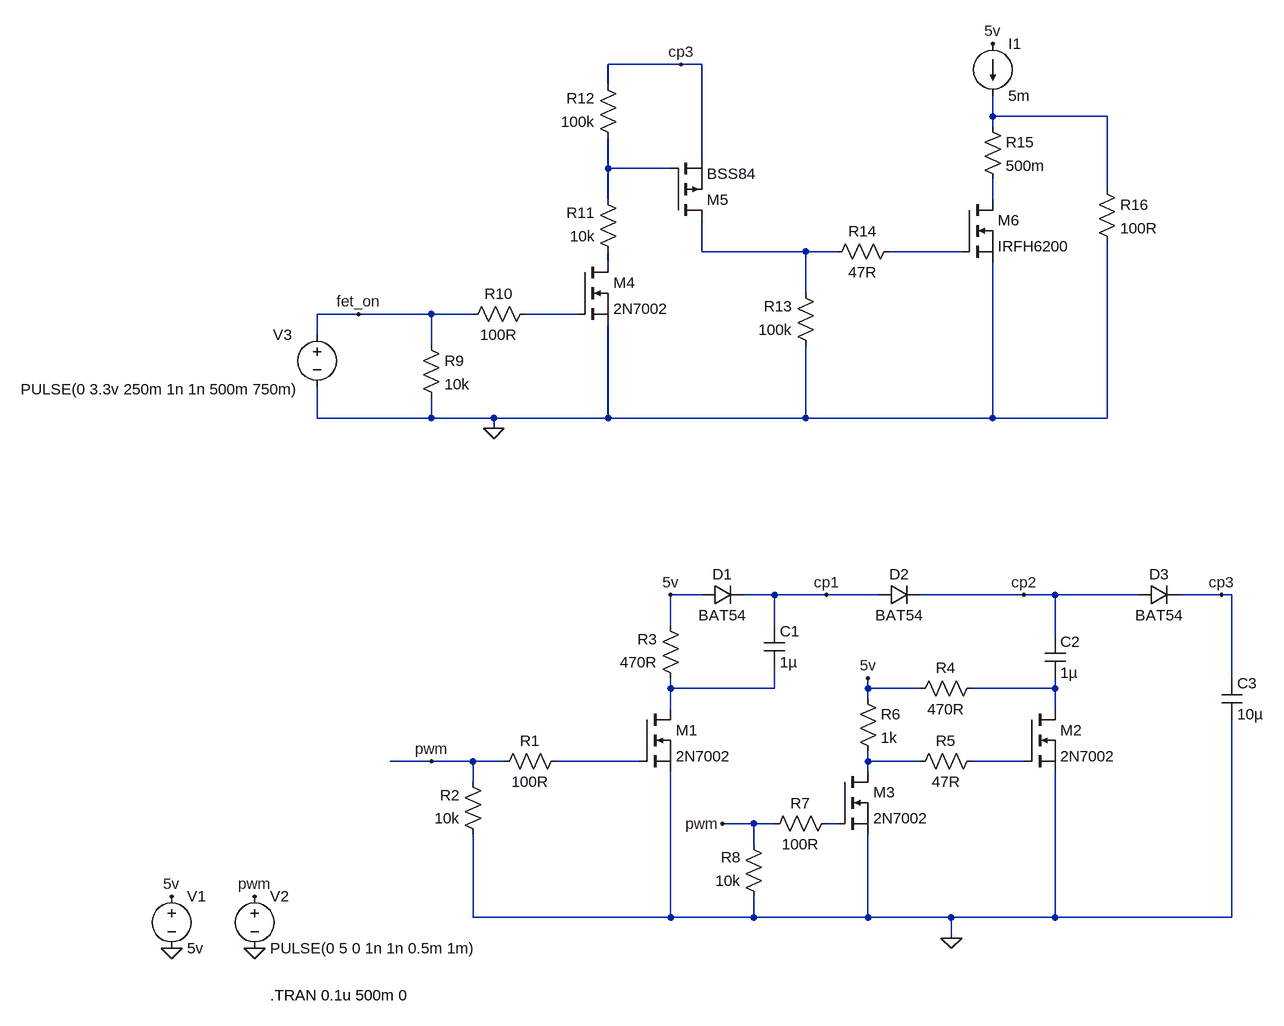
[diagram p0: schematic Charge Pump and FET Switch.asc]
Charge Pump and FET Switch.asc, the LTspice schematic file:
Version 4
SHEET 1 1676 760
WIRE 672 -688 560 -688
WIRE 704 -688 672 -688
WIRE 560 -656 560 -688
WIRE 1152 -608 1152 -640
WIRE 1328 -608 1152 -608
WIRE 1152 -592 1152 -608
WIRE 704 -544 704 -688
WIRE 560 -528 560 -576
WIRE 656 -528 560 -528
WIRE 1328 -496 1328 -608
WIRE 560 -480 560 -528
WIRE 1152 -480 1152 -512
WIRE 704 -400 704 -448
WIRE 864 -400 704 -400
WIRE 912 -400 864 -400
WIRE 1104 -400 992 -400
WIRE 560 -384 560 -400
WIRE 864 -336 864 -400
WIRE 176 -304 112 -304
WIRE 288 -304 176 -304
WIRE 352 -304 288 -304
WIRE 512 -304 432 -304
WIRE 112 -272 112 -304
WIRE 288 -256 288 -304
WIRE 112 -144 112 -192
WIRE 288 -144 288 -176
WIRE 288 -144 112 -144
WIRE 384 -144 288 -144
WIRE 560 -144 560 -288
WIRE 560 -144 384 -144
WIRE 864 -144 864 -256
WIRE 864 -144 560 -144
WIRE 1152 -144 1152 -384
WIRE 1152 -144 864 -144
WIRE 1328 -144 1328 -416
WIRE 1328 -144 1152 -144
WIRE 384 -128 384 -144
WIRE 704 128 656 128
WIRE 816 128 768 128
WIRE 896 128 816 128
WIRE 976 128 896 128
WIRE 1200 128 1040 128
WIRE 1248 128 1200 128
WIRE 1376 128 1248 128
WIRE 1504 128 1440 128
WIRE 1520 128 1504 128
WIRE 656 176 656 128
WIRE 816 176 816 128
WIRE 1248 192 1248 128
WIRE 1520 256 1520 128
WIRE 656 272 656 256
WIRE 816 272 816 240
WIRE 816 272 656 272
WIRE 960 272 960 256
WIRE 1040 272 960 272
WIRE 1248 272 1248 256
WIRE 1248 272 1120 272
WIRE 960 288 960 272
WIRE 656 304 656 272
WIRE 1248 304 1248 272
WIRE 288 384 224 384
WIRE 352 384 288 384
WIRE 400 384 352 384
WIRE 608 384 480 384
WIRE 960 384 960 368
WIRE 1040 384 960 384
WIRE 1200 384 1120 384
WIRE 960 400 960 384
WIRE 352 416 352 384
WIRE 784 480 736 480
WIRE 816 480 784 480
WIRE 912 480 896 480
WIRE 784 512 784 480
WIRE 352 624 352 496
WIRE 656 624 656 400
WIRE 656 624 352 624
WIRE 784 624 784 592
WIRE 784 624 656 624
WIRE 960 624 960 496
WIRE 960 624 784 624
WIRE 1088 624 960 624
WIRE 1248 624 1248 400
WIRE 1248 624 1088 624
WIRE 1520 624 1520 320
WIRE 1520 624 1248 624
WIRE 1088 656 1088 624
FLAG -112 672 0
FLAG -112 592 5v
FLAG 16 672 0
FLAG 16 592 pwm
FLAG 656 128 5v
FLAG 960 256 5v
FLAG 1504 128 cp3
FLAG 1088 656 0
FLAG 736 480 pwm
FLAG 288 384 pwm
FLAG 1152 -720 5v
FLAG 672 -688 cp3
FLAG 384 -128 0
FLAG 176 -304 fet_on
FLAG 896 128 cp1
FLAG 1200 128 cp2
SYMBOL voltage -112 576 R0
SYMATTR InstName V1
SYMATTR Value 5v
SYMBOL res 496 368 R90
WINDOW 0 0 56 VBottom 2
WINDOW 3 32 56 VTop 2
SYMATTR InstName R1
SYMATTR Value 100R
SYMBOL res 368 512 R180
WINDOW 0 36 76 Left 2
WINDOW 3 36 40 Left 2
SYMATTR InstName R2
SYMATTR Value 10k
SYMBOL res 672 272 R180
WINDOW 0 36 76 Left 2
WINDOW 3 36 40 Left 2
SYMATTR InstName R3
SYMATTR Value 470R
SYMBOL res 1024 288 R270
WINDOW 0 32 56 VTop 2
WINDOW 3 0 56 VBottom 2
SYMATTR InstName R4
SYMATTR Value 470R
SYMBOL res 1024 400 R270
WINDOW 0 32 56 VTop 2
WINDOW 3 0 56 VBottom 2
SYMATTR InstName R5
SYMATTR Value 47R
SYMBOL res 944 272 R0
SYMATTR InstName R6
SYMATTR Value 1k
SYMBOL cap 800 176 R0
SYMATTR InstName C1
SYMATTR Value 1µ
SYMBOL cap 1232 192 R0
SYMATTR InstName C2
SYMATTR Value 1µ
SYMBOL cap 1504 256 R0
SYMATTR InstName C3
SYMATTR Value 10µ
SYMBOL diode 704 144 R270
WINDOW 0 32 32 VTop 2
WINDOW 3 0 32 VBottom 2
SYMATTR InstName D1
SYMATTR Value BAT54
SYMBOL diode 976 144 R270
WINDOW 0 32 32 VTop 2
WINDOW 3 0 32 VBottom 2
SYMATTR InstName D2
SYMATTR Value BAT54
SYMBOL diode 1376 144 R270
WINDOW 0 32 32 VTop 2
WINDOW 3 0 32 VBottom 2
SYMATTR InstName D3
SYMATTR Value BAT54
SYMBOL nmos 608 304 R0
SYMATTR InstName M1
SYMATTR Value 2N7002
SYMBOL nmos 1200 304 R0
SYMATTR InstName M2
SYMATTR Value 2N7002
SYMBOL nmos 912 400 R0
SYMATTR InstName M3
SYMATTR Value 2N7002
SYMBOL voltage 16 576 R0
SYMATTR InstName V2
SYMATTR Value PULSE(0 5 0 1n 1n 0.5m 1m)
SYMBOL res 912 464 R90
WINDOW 0 0 56 VBottom 2
WINDOW 3 32 56 VTop 2
SYMATTR InstName R7
SYMATTR Value 100R
SYMBOL res 800 608 R180
WINDOW 0 36 76 Left 2
WINDOW 3 36 40 Left 2
SYMATTR InstName R8
SYMATTR Value 10k
SYMBOL res 272 -272 R0
SYMATTR InstName R9
SYMATTR Value 10k
SYMBOL res 448 -320 R90
WINDOW 0 0 56 VBottom 2
WINDOW 3 32 56 VTop 2
SYMATTR InstName R10
SYMATTR Value 100R
SYMBOL res 576 -384 R180
WINDOW 0 36 76 Left 2
WINDOW 3 36 40 Left 2
SYMATTR InstName R11
SYMATTR Value 10k
SYMBOL res 576 -560 R180
WINDOW 0 36 76 Left 2
WINDOW 3 36 40 Left 2
SYMATTR InstName R12
SYMATTR Value 100k
SYMBOL res 880 -240 R180
WINDOW 0 36 76 Left 2
WINDOW 3 36 40 Left 2
SYMATTR InstName R13
SYMATTR Value 100k
SYMBOL res 896 -384 R270
WINDOW 0 32 56 VTop 2
WINDOW 3 0 56 VBottom 2
SYMATTR InstName R14
SYMATTR Value 47R
SYMBOL res 1136 -608 R0
SYMATTR InstName R15
SYMATTR Value 500m
SYMBOL current 1152 -720 R0
SYMATTR InstName I1
SYMATTR Value 5m
SYMBOL res 1312 -512 R0
SYMATTR InstName R16
SYMATTR Value 100R
SYMBOL nmos 512 -384 R0
SYMATTR InstName M4
SYMATTR Value 2N7002
SYMBOL pmos 656 -448 M180
SYMATTR InstName M5
SYMATTR Value BSS84
SYMBOL nmos 1104 -480 R0
SYMATTR InstName M6
SYMATTR Value IRFH6200
SYMBOL voltage 112 -288 R0
WINDOW 0 -68 16 Left 2
WINDOW 3 -456 100 Left 2
SYMATTR InstName V3
SYMATTR Value PULSE(0 3.3v 250m 1n 1n 500m 750m)
TEXT 40 744 Left 2 !.TRAN 0.1u 500m 0

The netlist it stands for:
* Charge Pump and FET Switch.asc
V1 5v 0 5v
R1 N010 pwm 100R
R2 0 pwm 10k
R3 N008 5v 470R
R4 5v N009 470R
R5 N011 N012 47R
R6 5v N011 1k
C1 cp1 N008 1µ
C2 cp2 N009 1µ
C3 cp3 0 10µ
D1 5v cp1 BAT54
D2 cp1 cp2 BAT54
D3 cp2 cp3 BAT54
M1 N008 N010 0 0 2N7002
M2 N009 N012 0 0 2N7002
M3 N011 N013 0 0 2N7002
V2 pwm 0 PULSE(0 5 0 1n 1n 0.5m 1m)
R7 N013 pwm 100R
R8 0 pwm 10k
R9 fet_on 0 10k
R10 N007 fet_on 100R
R11 N006 N002 10k
R12 N002 cp3 100k
R13 0 N004 100k
R14 N004 N005 47R
R15 N001 N003 500m
I1 5v N001 5m
R16 N001 0 100R
M4 N006 N007 0 0 2N7002
M5 N004 N002 cp3 cp3 BSS84
M6 N003 N005 0 0 IRFH6200
V3 fet_on 0 PULSE(0 3.3v 250m 1n 1n 500m 750m)
.model D D
.lib standard.dio
.model NMOS NMOS
.model PMOS PMOS
.lib standard.mos
.TRAN 0.1u 500m 0
.backanno
.end